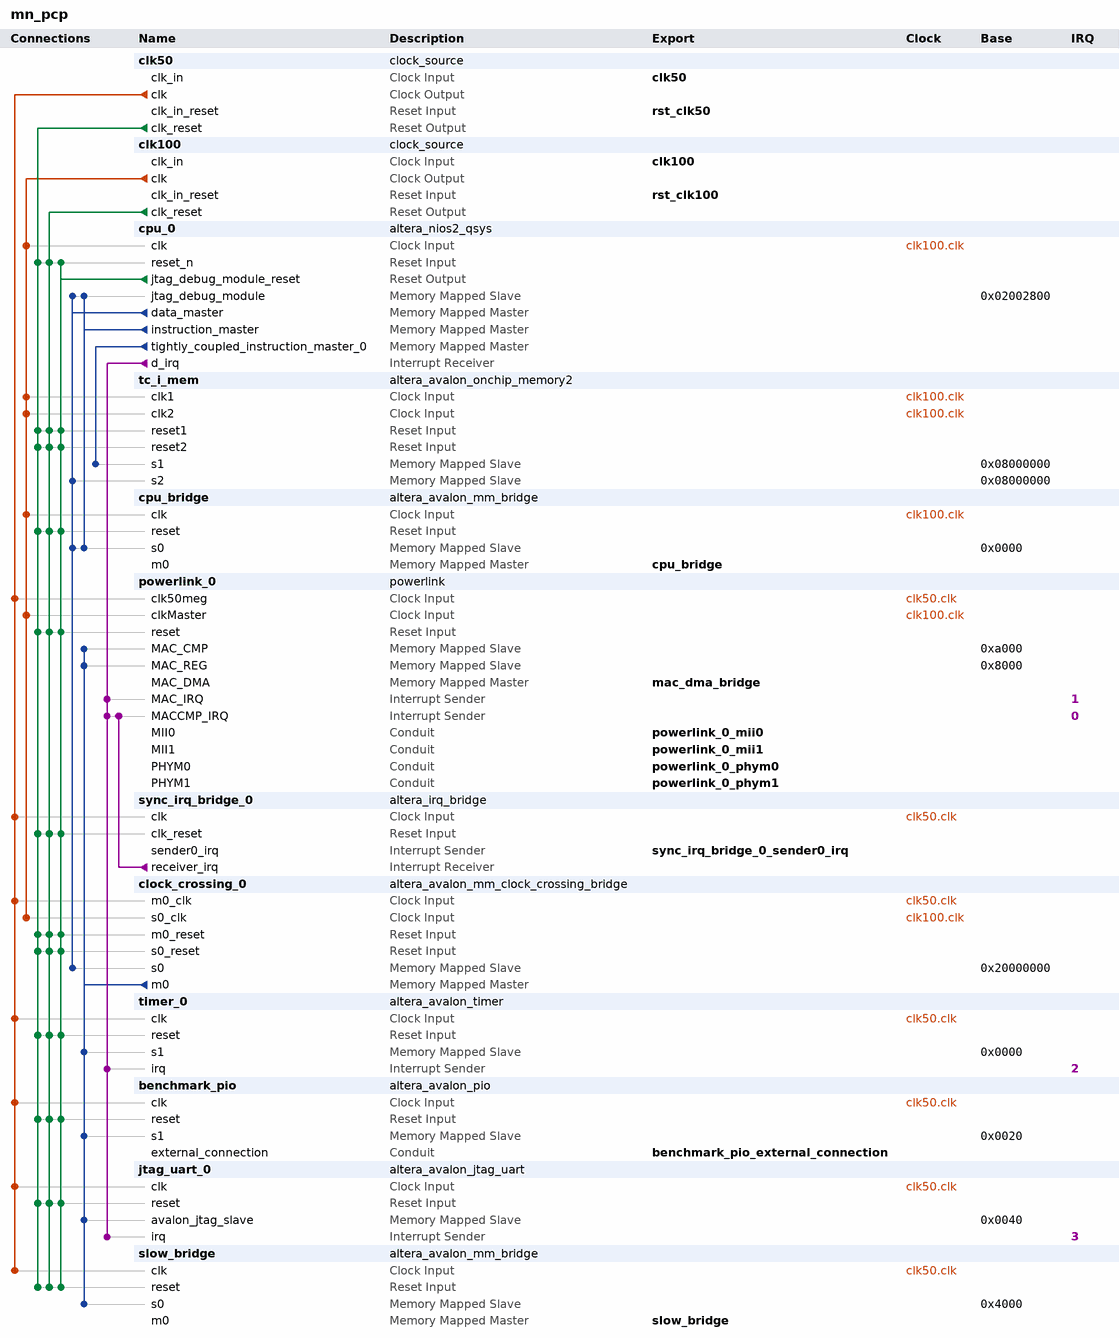
[diagram p0: system contents]
# Platform Designer (Qsys) system mn_pcp, Cyclone IV E EP4CE115F29C7
# Parameters at their usual value, and those the tool derives, are not listed.
package require -exact qsys 13.0
create_system mn_pcp
set_project_property DEVICE_FAMILY {Cyclone IV E}
set_project_property DEVICE EP4CE115F29C7

add_instance clk50 clock_source 13.0
set_instance_parameter_value clk50 clockFrequency 50000000

add_instance clk100 clock_source 13.0
set_instance_parameter_value clk100 clockFrequency 100000000

add_instance cpu_0 altera_nios2_qsys 13.0
set_instance_parameter_value cpu_0 cpuID 1
set_instance_parameter_value cpu_0 resetSlave tc_i_mem.s1
set_instance_parameter_value cpu_0 exceptionSlave tc_i_mem.s1
set_instance_parameter_value cpu_0 breakSlave cpu_0.jtag_debug_module
set_instance_parameter_value cpu_0 impl Fast
set_instance_parameter_value cpu_0 icache_size 4096
set_instance_parameter_value cpu_0 icache_numTCIM 1
set_instance_parameter_value cpu_0 dcache_size 4096
set_instance_parameter_value cpu_0 dcache_lineSize 4

add_instance tc_i_mem altera_avalon_onchip_memory2 13.0.1.99.2
set_instance_parameter_value tc_i_mem dataWidth 32
set_instance_parameter_value tc_i_mem dualPort true
set_instance_parameter_value tc_i_mem initMemContent true
set_instance_parameter_value tc_i_mem initializationFileName tc_i_mem
set_instance_parameter_value tc_i_mem memorySize 20480

add_instance cpu_bridge altera_avalon_mm_bridge 13.0
set_instance_parameter_value cpu_bridge DATA_WIDTH 32
set_instance_parameter_value cpu_bridge ADDRESS_WIDTH 22
set_instance_parameter_value cpu_bridge ADDRESS_UNITS SYMBOLS
set_instance_parameter_value cpu_bridge MAX_PENDING_RESPONSES 1
set_instance_parameter_value cpu_bridge PIPELINE_COMMAND 0
set_instance_parameter_value cpu_bridge PIPELINE_RESPONSE 0

add_instance powerlink_0 powerlink 0.3.0
set_instance_parameter_value powerlink_0 pcpSysId 1
set_instance_parameter_value powerlink_0 expertMode true
set_instance_parameter_value powerlink_0 clkRateEth 0
set_instance_parameter_value powerlink_0 clkRate50 50000000
set_instance_parameter_value powerlink_0 clkRatePcp 0
set_instance_parameter_value powerlink_0 configPowerlink {openMAC only}
set_instance_parameter_value powerlink_0 configApInterface Avalon
set_instance_parameter_value powerlink_0 configApParallelInterface 8bit
set_instance_parameter_value powerlink_0 configApParSigs {High Active}
set_instance_parameter_value powerlink_0 configApParOutSigs {High Active}
set_instance_parameter_value powerlink_0 configApSpi_CPOL 0
set_instance_parameter_value powerlink_0 configApSpi_CPHA 0
set_instance_parameter_value powerlink_0 configApSpi_IRQ {High Active}
set_instance_parameter_value powerlink_0 rpdoNum 3
set_instance_parameter_value powerlink_0 rpdo0size 1
set_instance_parameter_value powerlink_0 tpdoNum 1
set_instance_parameter_value powerlink_0 tpdo0size 1
set_instance_parameter_value powerlink_0 genLedGadget true
set_instance_parameter_value powerlink_0 genEvent true
set_instance_parameter_value powerlink_0 asyncBuf1Size 1514
set_instance_parameter_value powerlink_0 asyncBuf2Size 1514
set_instance_parameter_value powerlink_0 phyIF MII
set_instance_parameter_value powerlink_0 packetLoc {TX and RX over Avalon Master}
set_instance_parameter_value powerlink_0 validSet 1
set_instance_parameter_value powerlink_0 macTxBuf 7000
set_instance_parameter_value powerlink_0 macRxBuf 16
set_instance_parameter_value powerlink_0 hwSupportSyncIrq false
set_instance_parameter_value powerlink_0 mac2phys true
set_instance_parameter_value powerlink_0 macGen2ndSmi true
set_instance_parameter_value powerlink_0 macTxBurstSize 16
set_instance_parameter_value powerlink_0 macRxBurstSize 16
set_instance_parameter_value powerlink_0 enDmaObserver true
set_instance_parameter_value powerlink_0 macRxQueueNum 2
set_instance_parameter_value powerlink_0 macRxQueue1Size 5
set_instance_parameter_value powerlink_0 macRxQueue2Size 5
set_instance_parameter_value powerlink_0 macRxQueue3Size 5
set_instance_parameter_value powerlink_0 macRxQueue4Size 5
set_instance_parameter_value powerlink_0 macRxQueue5Size 5

add_instance sync_irq_bridge_0 altera_irq_bridge 13.0
set_instance_parameter_value sync_irq_bridge_0 IRQ_WIDTH 1

add_instance clock_crossing_0 altera_avalon_mm_clock_crossing_bridge 13.0
set_instance_parameter_value clock_crossing_0 DATA_WIDTH 32
set_instance_parameter_value clock_crossing_0 ADDRESS_WIDTH 16
set_instance_parameter_value clock_crossing_0 MAX_BURST_SIZE 1
set_instance_parameter_value clock_crossing_0 COMMAND_FIFO_DEPTH 4
set_instance_parameter_value clock_crossing_0 RESPONSE_FIFO_DEPTH 4
set_instance_parameter_value clock_crossing_0 MASTER_SYNC_DEPTH 2
set_instance_parameter_value clock_crossing_0 SLAVE_SYNC_DEPTH 2

add_instance timer_0 altera_avalon_timer 13.0.1.99.2
set_instance_parameter_value timer_0 alwaysRun true
set_instance_parameter_value timer_0 fixedPeriod true
set_instance_parameter_value timer_0 period 1
set_instance_parameter_value timer_0 periodUnits MSEC
set_instance_parameter_value timer_0 snapshot false

add_instance benchmark_pio altera_avalon_pio 13.0.1.99.2
set_instance_parameter_value benchmark_pio bitModifyingOutReg true
set_instance_parameter_value benchmark_pio direction Output
set_instance_parameter_value benchmark_pio width 8

add_instance jtag_uart_0 altera_avalon_jtag_uart 13.0.1.99.2
set_instance_parameter_value jtag_uart_0 simInteractiveOptions INTERACTIVE_ASCII_OUTPUT

add_instance slow_bridge altera_avalon_mm_bridge 13.0
set_instance_parameter_value slow_bridge DATA_WIDTH 32
set_instance_parameter_value slow_bridge ADDRESS_WIDTH 14
set_instance_parameter_value slow_bridge ADDRESS_UNITS SYMBOLS
set_instance_parameter_value slow_bridge MAX_PENDING_RESPONSES 1
set_instance_parameter_value slow_bridge PIPELINE_COMMAND 0
set_instance_parameter_value slow_bridge PIPELINE_RESPONSE 0

# connections
add_connection clk50.clk benchmark_pio.clk clock
add_connection clk50.clk clock_crossing_0.m0_clk clock
add_connection clk50.clk jtag_uart_0.clk clock
add_connection clk50.clk powerlink_0.clk50meg clock
add_connection clk50.clk slow_bridge.clk clock
add_connection clk50.clk sync_irq_bridge_0.clk clock
add_connection clk50.clk timer_0.clk clock
add_connection clk100.clk clock_crossing_0.s0_clk clock
add_connection clk100.clk cpu_0.clk clock
add_connection clk100.clk cpu_bridge.clk clock
add_connection clk100.clk powerlink_0.clkMaster clock
add_connection clk100.clk tc_i_mem.clk1 clock
add_connection clk100.clk tc_i_mem.clk2 clock
add_connection clk50.clk_reset benchmark_pio.reset reset
add_connection clk50.clk_reset clock_crossing_0.m0_reset reset
add_connection clk50.clk_reset clock_crossing_0.s0_reset reset
add_connection clk50.clk_reset cpu_0.reset_n reset
add_connection clk50.clk_reset cpu_bridge.reset reset
add_connection clk50.clk_reset jtag_uart_0.reset reset
add_connection clk50.clk_reset powerlink_0.reset reset
add_connection clk50.clk_reset slow_bridge.reset reset
add_connection clk50.clk_reset sync_irq_bridge_0.clk_reset reset
add_connection clk50.clk_reset tc_i_mem.reset1 reset
add_connection clk50.clk_reset tc_i_mem.reset2 reset
add_connection clk50.clk_reset timer_0.reset reset
add_connection clk100.clk_reset benchmark_pio.reset reset
add_connection clk100.clk_reset clock_crossing_0.m0_reset reset
add_connection clk100.clk_reset clock_crossing_0.s0_reset reset
add_connection clk100.clk_reset cpu_0.reset_n reset
add_connection clk100.clk_reset cpu_bridge.reset reset
add_connection clk100.clk_reset jtag_uart_0.reset reset
add_connection clk100.clk_reset powerlink_0.reset reset
add_connection clk100.clk_reset slow_bridge.reset reset
add_connection clk100.clk_reset sync_irq_bridge_0.clk_reset reset
add_connection clk100.clk_reset tc_i_mem.reset1 reset
add_connection clk100.clk_reset tc_i_mem.reset2 reset
add_connection clk100.clk_reset timer_0.reset reset
add_connection cpu_0.jtag_debug_module_reset benchmark_pio.reset reset
add_connection cpu_0.jtag_debug_module_reset clock_crossing_0.m0_reset reset
add_connection cpu_0.jtag_debug_module_reset clock_crossing_0.s0_reset reset
add_connection cpu_0.jtag_debug_module_reset cpu_0.reset_n reset
add_connection cpu_0.jtag_debug_module_reset cpu_bridge.reset reset
add_connection cpu_0.jtag_debug_module_reset jtag_uart_0.reset reset
add_connection cpu_0.jtag_debug_module_reset powerlink_0.reset reset
add_connection cpu_0.jtag_debug_module_reset slow_bridge.reset reset
add_connection cpu_0.jtag_debug_module_reset sync_irq_bridge_0.clk_reset reset
add_connection cpu_0.jtag_debug_module_reset tc_i_mem.reset1 reset
add_connection cpu_0.jtag_debug_module_reset tc_i_mem.reset2 reset
add_connection cpu_0.jtag_debug_module_reset timer_0.reset reset
add_connection clock_crossing_0.m0 benchmark_pio.s1 avalon
set_connection_parameter_value clock_crossing_0.m0/benchmark_pio.s1 baseAddress 0x0020
add_connection clock_crossing_0.m0 jtag_uart_0.avalon_jtag_slave avalon
set_connection_parameter_value clock_crossing_0.m0/jtag_uart_0.avalon_jtag_slave baseAddress 0x0040
add_connection clock_crossing_0.m0 powerlink_0.MAC_CMP avalon
set_connection_parameter_value clock_crossing_0.m0/powerlink_0.MAC_CMP baseAddress 0xa000
add_connection clock_crossing_0.m0 powerlink_0.MAC_REG avalon
set_connection_parameter_value clock_crossing_0.m0/powerlink_0.MAC_REG baseAddress 0x8000
add_connection clock_crossing_0.m0 slow_bridge.s0 avalon
set_connection_parameter_value clock_crossing_0.m0/slow_bridge.s0 baseAddress 0x4000
add_connection clock_crossing_0.m0 timer_0.s1 avalon
set_connection_parameter_value clock_crossing_0.m0/timer_0.s1 baseAddress 0x0000
add_connection cpu_0.data_master clock_crossing_0.s0 avalon
set_connection_parameter_value cpu_0.data_master/clock_crossing_0.s0 baseAddress 0x20000000
add_connection cpu_0.data_master cpu_0.jtag_debug_module avalon
set_connection_parameter_value cpu_0.data_master/cpu_0.jtag_debug_module baseAddress 0x02002800
add_connection cpu_0.data_master cpu_bridge.s0 avalon
set_connection_parameter_value cpu_0.data_master/cpu_bridge.s0 baseAddress 0x0000
add_connection cpu_0.data_master tc_i_mem.s2 avalon
set_connection_parameter_value cpu_0.data_master/tc_i_mem.s2 baseAddress 0x08000000
add_connection cpu_0.instruction_master cpu_0.jtag_debug_module avalon
set_connection_parameter_value cpu_0.instruction_master/cpu_0.jtag_debug_module baseAddress 0x02002800
add_connection cpu_0.instruction_master cpu_bridge.s0 avalon
set_connection_parameter_value cpu_0.instruction_master/cpu_bridge.s0 baseAddress 0x0000
add_connection cpu_0.tightly_coupled_instruction_master_0 tc_i_mem.s1 avalon
set_connection_parameter_value cpu_0.tightly_coupled_instruction_master_0/tc_i_mem.s1 baseAddress 0x08000000
add_connection cpu_0.d_irq jtag_uart_0.irq interrupt
set_connection_parameter_value cpu_0.d_irq/jtag_uart_0.irq irqNumber 3
add_connection cpu_0.d_irq powerlink_0.MAC_IRQ interrupt
set_connection_parameter_value cpu_0.d_irq/powerlink_0.MAC_IRQ irqNumber 1
add_connection cpu_0.d_irq powerlink_0.MACCMP_IRQ interrupt
set_connection_parameter_value cpu_0.d_irq/powerlink_0.MACCMP_IRQ irqNumber 0
add_connection cpu_0.d_irq timer_0.irq interrupt
set_connection_parameter_value cpu_0.d_irq/timer_0.irq irqNumber 2
add_connection sync_irq_bridge_0.receiver_irq powerlink_0.MACCMP_IRQ interrupt
set_connection_parameter_value sync_irq_bridge_0.receiver_irq/powerlink_0.MACCMP_IRQ irqNumber 0

# exported interfaces
add_interface clk50 clock sink
set_interface_property clk50 EXPORT_OF clk50.clk_in
add_interface rst_clk50 reset sink
set_interface_property rst_clk50 EXPORT_OF clk50.clk_in_reset
add_interface clk100 clock sink
set_interface_property clk100 EXPORT_OF clk100.clk_in
add_interface rst_clk100 reset sink
set_interface_property rst_clk100 EXPORT_OF clk100.clk_in_reset
add_interface benchmark_pio_external_connection conduit end
set_interface_property benchmark_pio_external_connection EXPORT_OF benchmark_pio.external_connection
add_interface powerlink_0_phym0 conduit end
set_interface_property powerlink_0_phym0 EXPORT_OF powerlink_0.PHYM0
add_interface powerlink_0_phym1 conduit end
set_interface_property powerlink_0_phym1 EXPORT_OF powerlink_0.PHYM1
add_interface powerlink_0_mii0 conduit end
set_interface_property powerlink_0_mii0 EXPORT_OF powerlink_0.MII0
add_interface powerlink_0_mii1 conduit end
set_interface_property powerlink_0_mii1 EXPORT_OF powerlink_0.MII1
add_interface sync_irq_bridge_0_sender0_irq interrupt sender
set_interface_property sync_irq_bridge_0_sender0_irq EXPORT_OF sync_irq_bridge_0.sender0_irq
add_interface slow_bridge avalon master
set_interface_property slow_bridge EXPORT_OF slow_bridge.m0
add_interface cpu_bridge avalon master
set_interface_property cpu_bridge EXPORT_OF cpu_bridge.m0
add_interface mac_dma_bridge avalon master
set_interface_property mac_dma_bridge EXPORT_OF powerlink_0.MAC_DMA

set_interconnect_requirement {$system} qsys_mm.clockCrossingAdapter HANDSHAKE
set_interconnect_requirement {$system} qsys_mm.maxAdditionalLatency 0

save_system mn_pcp.qsys
